# EAGLE design shield (EAGLE 7.7.0)
DRAWING_NUMBER: V001; DRAWN: Mario Blunk / Blunk electronic; PROJECT: agile HW demo; STATUS: development

## Sheet 1 of 4: connector core
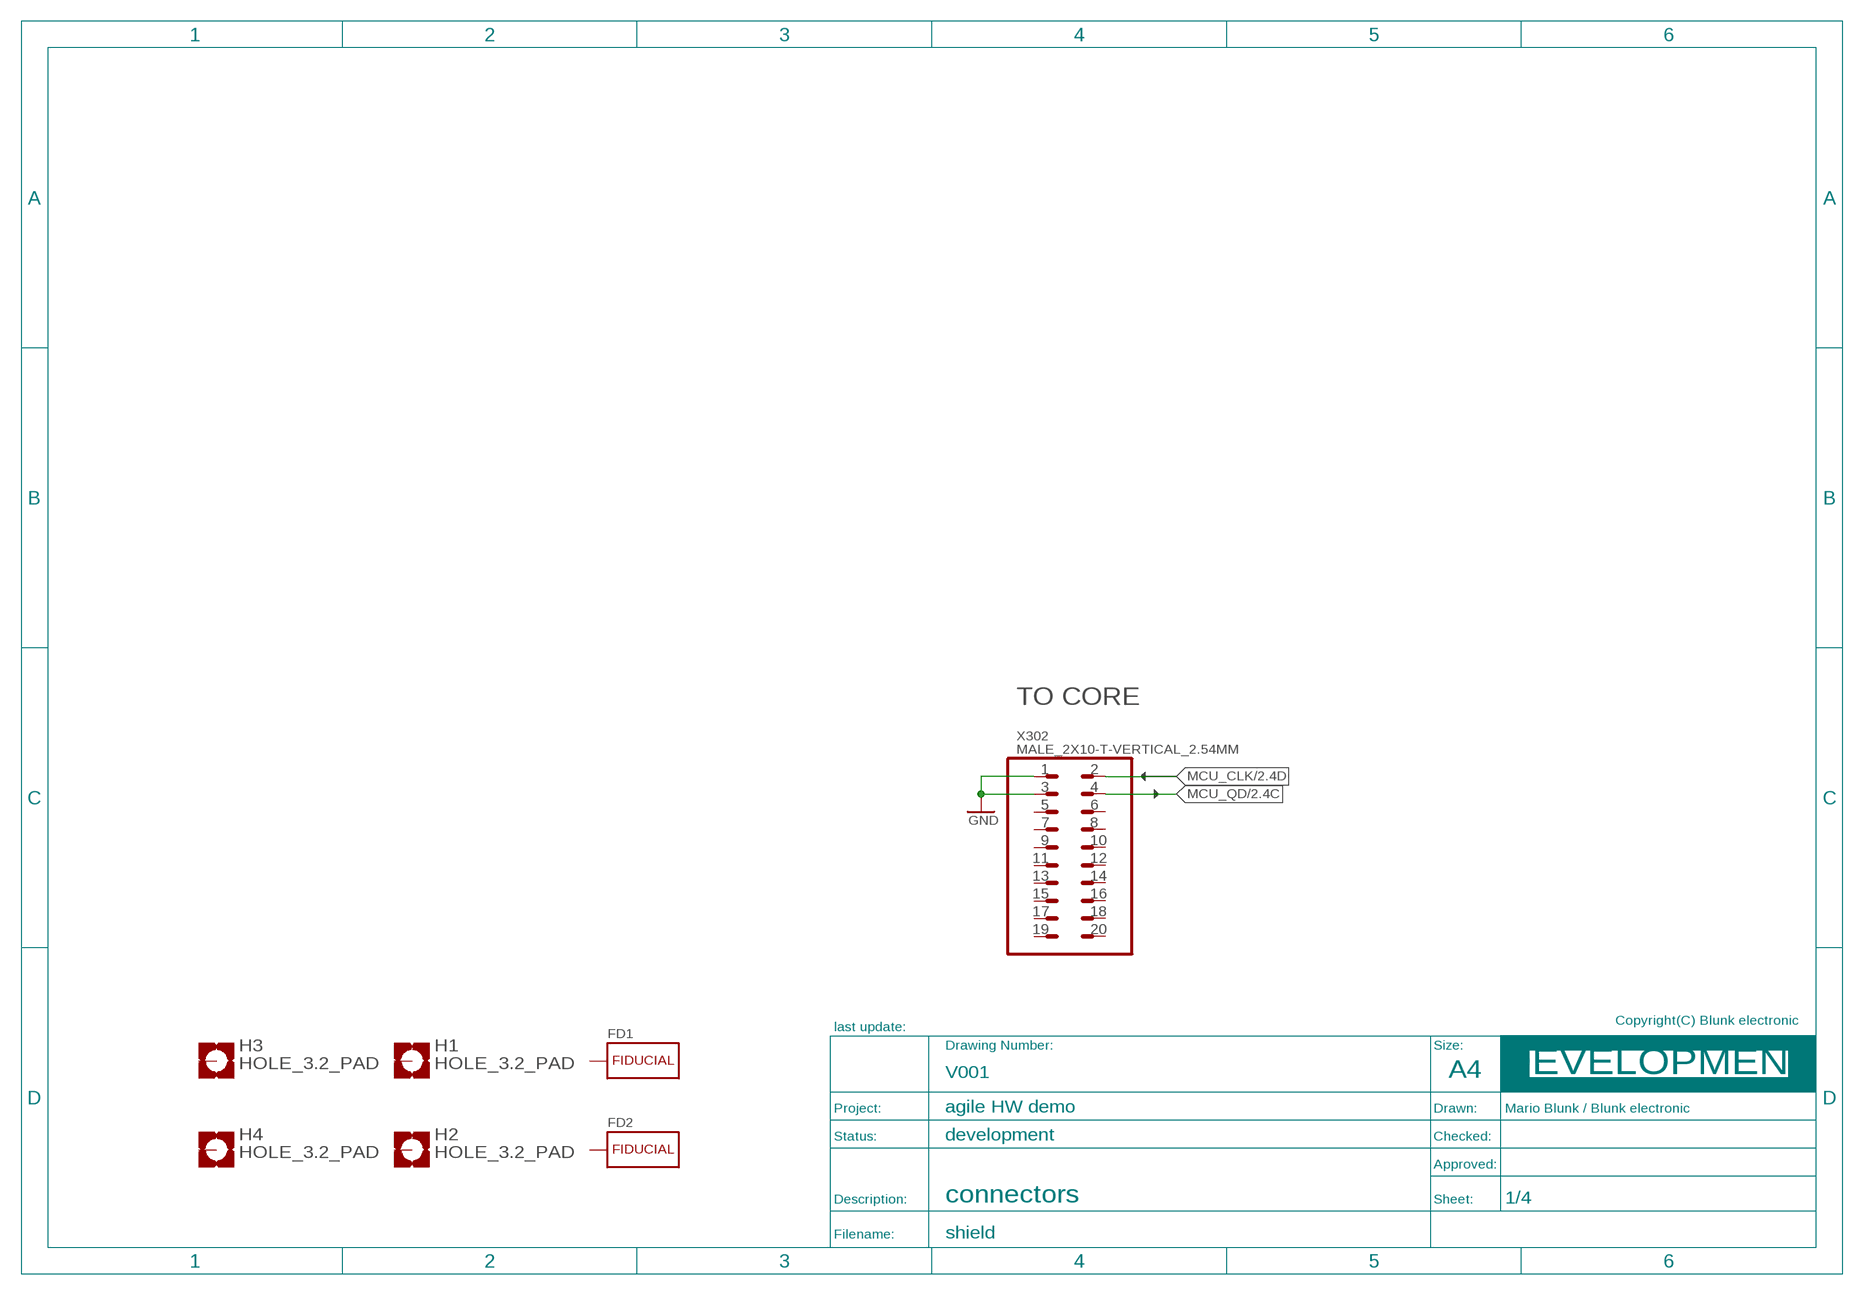
[diagram p0: schematic, sheet 1]
FRAME_DEVELOPMENT1 (A4_LANDSCAPE_DEVELOPMENT): BOM: NO; COMMISSIONED: 2013-08-30; DESCRIPTION: connectors
U$10 (ARROW_1): BOM: NO; COMMISSIONED: 2013-08-30
U$11 (ARROW_1): BOM: NO; COMMISSIONED: 2013-08-30

### Parts
FD1  FIDUCIAL_CROSSHAIR  [CROSSHAIR]
FD2  FIDUCIAL_CROSSHAIR  [CROSSHAIR]
H1  HOLE_3.2_PAD  [3.2_PAD]
H2  HOLE_3.2_PAD  [3.2_PAD]
H3  HOLE_3.2_PAD  [3.2_PAD]
H4  HOLE_3.2_PAD  [3.2_PAD]
X302  MALE_2X10-T-VERTICAL_2.54MM  [T_MALE_2X10_VERTICAL_GRID_2.54MM]

### Nets
GND: X302.1 X302.3 ; also sheet 3,4
MCU_CLK: X302.2 ; also sheet 2
MCU_QD: X302.4 ; also sheet 2
Unconnected: FD1.1(NC) FD2.1(NC) H1.H1(MOUNT) H2.H1(MOUNT) H3.H1(MOUNT) H4.H1(MOUNT) X302.5 X302.6 X302.7 X302.8 X302.9 X302.10 X302.11 X302.12 X302.13 X302.14 X302.15 X302.16 X302.17 X302.18 X302.19 X302.20

## Sheet 2 of 4: routing
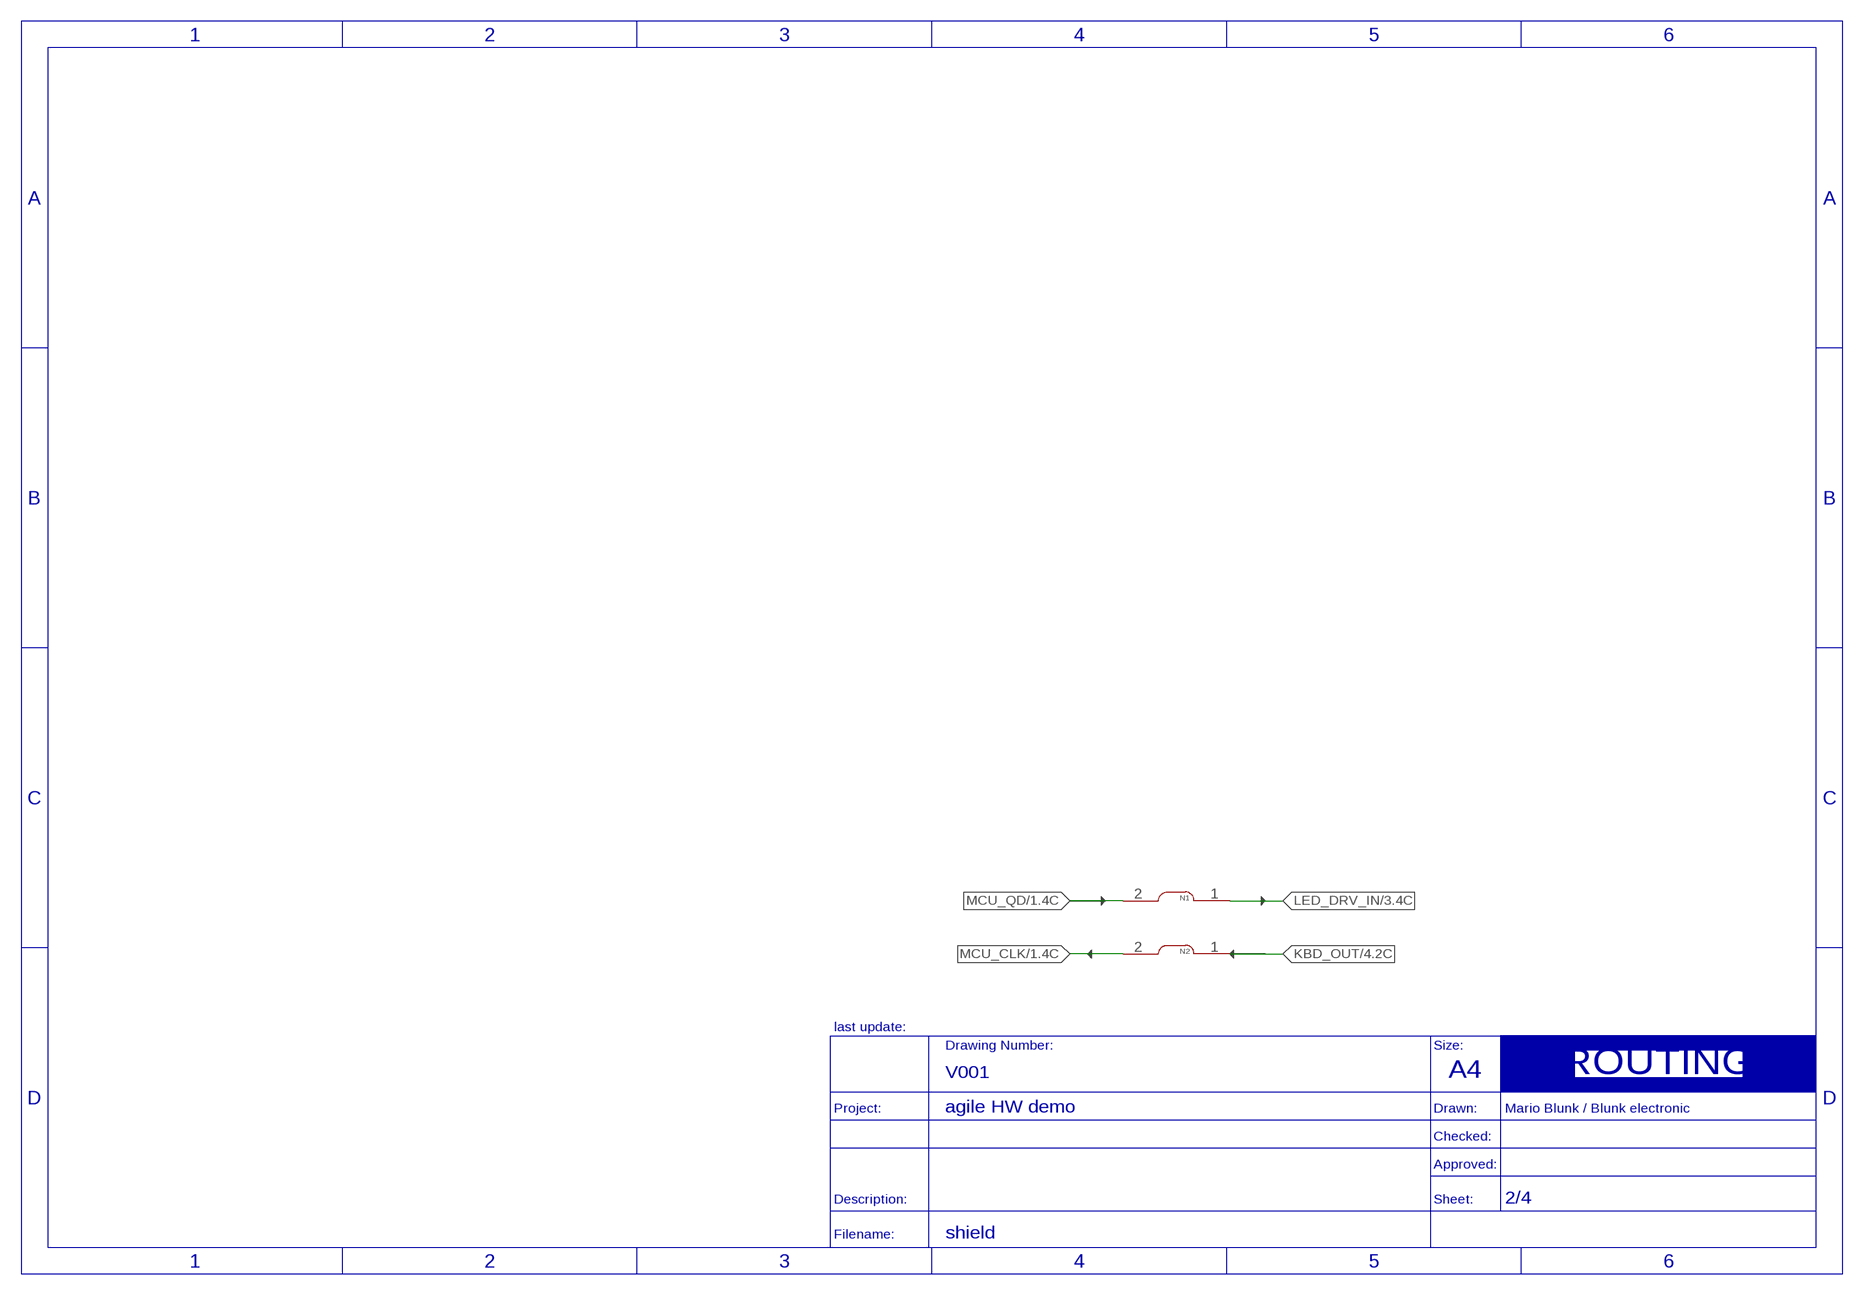
[diagram p1: schematic, sheet 2]
FRAME_NET_CHANGERS1 (A4_LANDSCAPE_NET_CHANGERS): BOM: NO; COMMISSIONED: 2013-08-30
U$2 (ARROW_1): BOM: NO; COMMISSIONED: 2013-08-30
U$3 (ARROW_1): BOM: NO; COMMISSIONED: 2013-08-30
U$4 (ARROW_1): BOM: NO; COMMISSIONED: 2013-08-30
U$5 (ARROW_1): BOM: NO; COMMISSIONED: 2013-08-30

### Parts
N1  NET_CHANGER-S-0.3MM  [S_NET_CHANGER_0.3MM]
N2  NET_CHANGER-S-0.15MM  [S_NET_CHANGER_0.15MM]

### Nets
KBD_OUT: N2.1 ; also sheet 4
LED_DRV_IN: N1.1 ; also sheet 3
MCU_CLK: N2.2 ; also sheet 1
MCU_QD: N1.2 ; also sheet 1

## Sheet 3 of 4: connector LED driver module
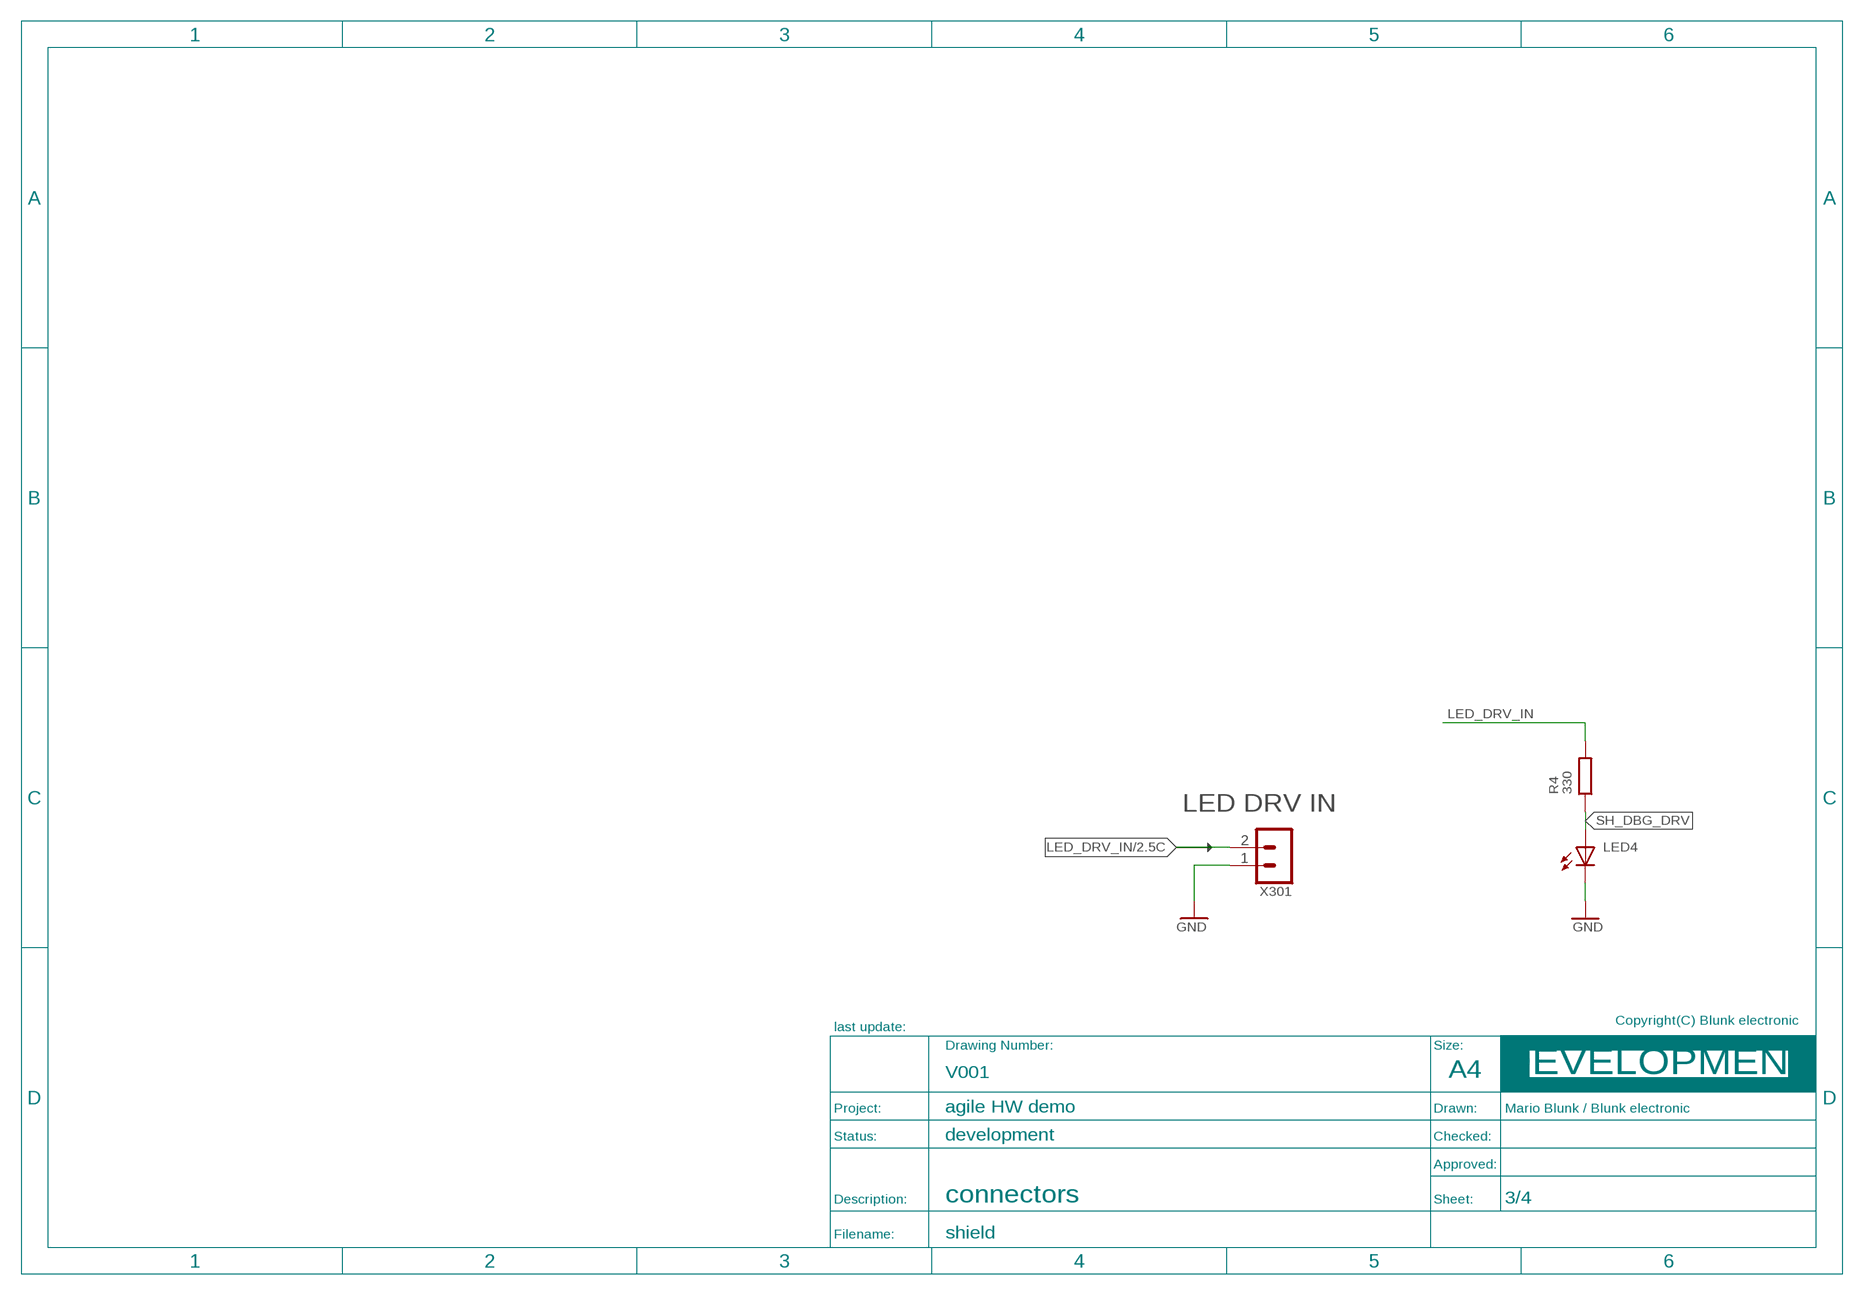
[diagram p2: schematic, sheet 3]
FRAME_DEVELOPMENT2 (A4_LANDSCAPE_DEVELOPMENT): BOM: NO; COMMISSIONED: 2013-08-30; DESCRIPTION: connectors
U$1 (ARROW_1): BOM: NO; COMMISSIONED: 2013-08-30

### Parts
LED4  LED_S_0805  [S_0805]
R4  330  R_S_0805  [S_0805]
X301  MALE_2X1-T-VERTICAL  [T_MALE_2X1_VERTICAL_PITCH_2MM54]

### Nets
GND: LED4.C X301.1 ; also sheet 1,4
LED_DRV_IN: R4.2 X301.2 ; also sheet 2
SH_DBG_DRV: LED4.A R4.1

## Sheet 4 of 4: connector keyboard module
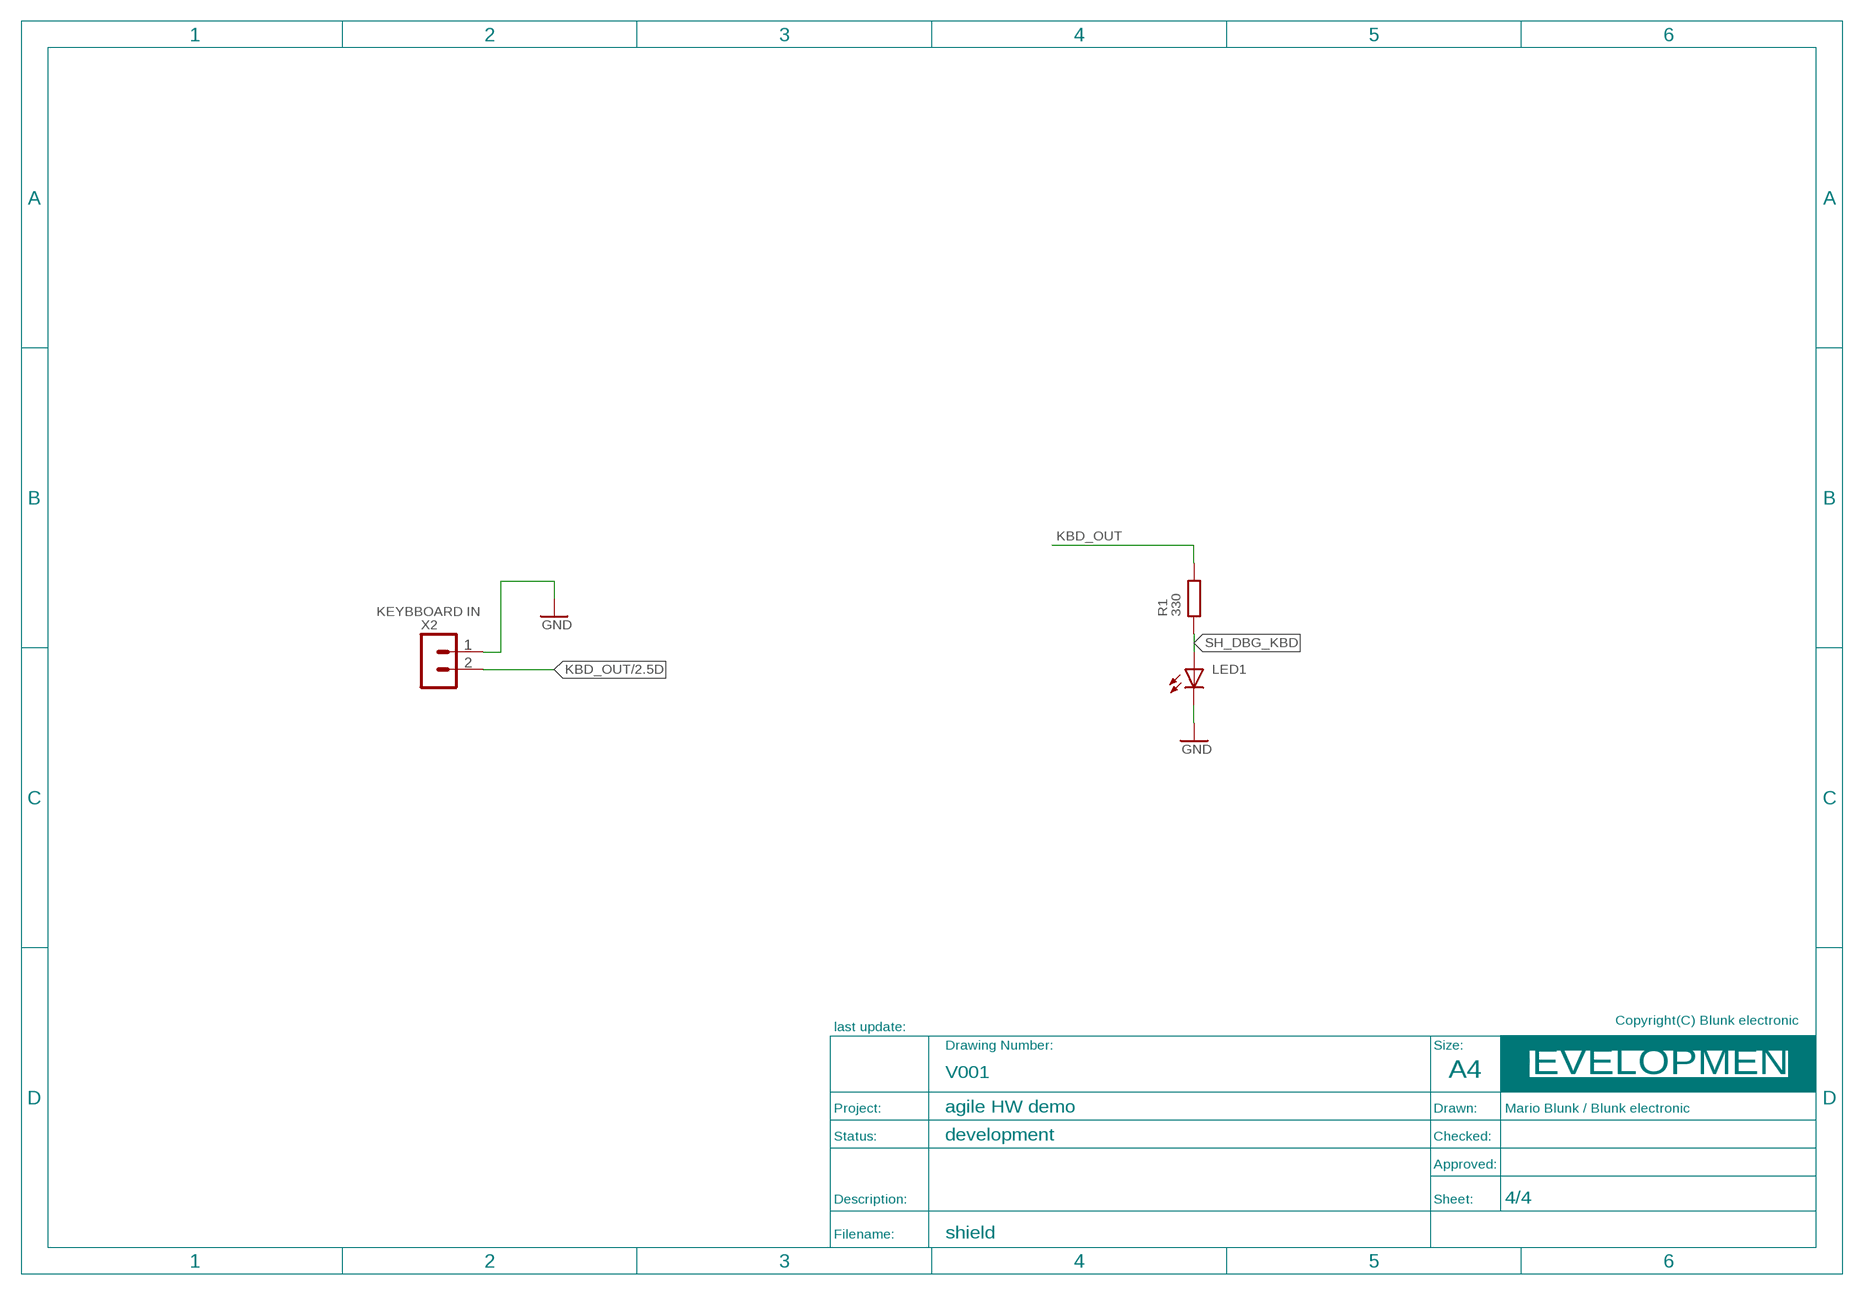
[diagram p3: schematic, sheet 4]
FRAME_DEVELOPMENT3 (A4_LANDSCAPE_DEVELOPMENT): BOM: NO; COMMISSIONED: 2013-08-30

### Parts
LED1  LED_S_0805  [S_0805]
R1  330  R_S_0805  [S_0805]
X2  MALE_2X1-T-VERTICAL  [T_MALE_2X1_VERTICAL_PITCH_2MM54]

### Nets
GND: LED1.C X2.1 ; also sheet 1,3
KBD_OUT: R1.2 X2.2 ; also sheet 2
SH_DBG_KBD: LED1.A R1.1

## Library data of the parts
FD1 FD2 = be_marks:FIDUCIAL: drawn: Mario Blunk / Blunk electronic; BOM: NO; COMMISSIONED: 2013-12-03
H1-H4 = be_holes:HOLE: edited: Mario Blunk; BOM: NO; COMMISSIONED: 2015-01-15
LED1 = be_opt:LED: single LED device drawn: Mario Blunk / Blunk electronic; BOM: YES; COMMISSIONED: 2013-08-30; FUNCTION: BOTTON PRESSED; PART_CODE_BEL: LED_PAC_S_0805_VAL_
LED4 = be_opt:LED: single LED device drawn: Mario Blunk / Blunk electronic; BOM: YES; COMMISSIONED: 2013-08-30; FUNCTION: LIGHT ACTIVE; PART_CODE_BEL: LED_PAC_S_0805_VAL_
N1 = be_con_jump:NET_CHANGER: drawn: Mario Blunk / Blunk electronic; BOM: NO; COMMISSIONED: 2014-04-09; PART_CODE_BEL: N_PAC_S_NET_CHANGER_0.3MM
N2 = be_con_jump:NET_CHANGER: drawn: Mario Blunk / Blunk electronic; BOM: NO; COMMISSIONED: 2013-08-30; PART_CODE_BEL: N_PAC_S_NET_CHANGER_0.15MM
R1 R4 = be_rcl:R: edited: Mario Blunk / Blunk electronic; BOM: YES; COMMISSIONED: 2013-08-30; PART_CODE_BEL: R_PAC_S_0805_VAL_
X2 = be_con_jump:MALE_2X1: edited: Mario Blunk / Blunk electronic; BOM: YES; COMMISSIONED: 2013-08-30; FUNCTION: KEYBBOARD IN; PART_CODE_BEL: X_PAC_T_MALE_2X1_VERTICAL_PITCH_2mm54; UPDATED: 2018-08-01
X301 = be_con_jump:MALE_2X1: edited: Mario Blunk / Blunk electronic; BOM: YES; COMMISSIONED: 2013-08-30; FUNCTION: LED DRV IN; PART_CODE_BEL: X_PAC_T_MALE_2X1_VERTICAL_PITCH_2mm54; UPDATED: 2018-08-01
X302 = be_con_jump:MALE_2X10: drawn: Mario Blunk / Blunk electronic; BOM: YES; COMMISSIONED: 2013-08-30; FUNCTION: TO CORE; PART_CODE_BEL: X_PAC_T_MALE_2X10_VERTICAL_GRID_2.54mm

## Board
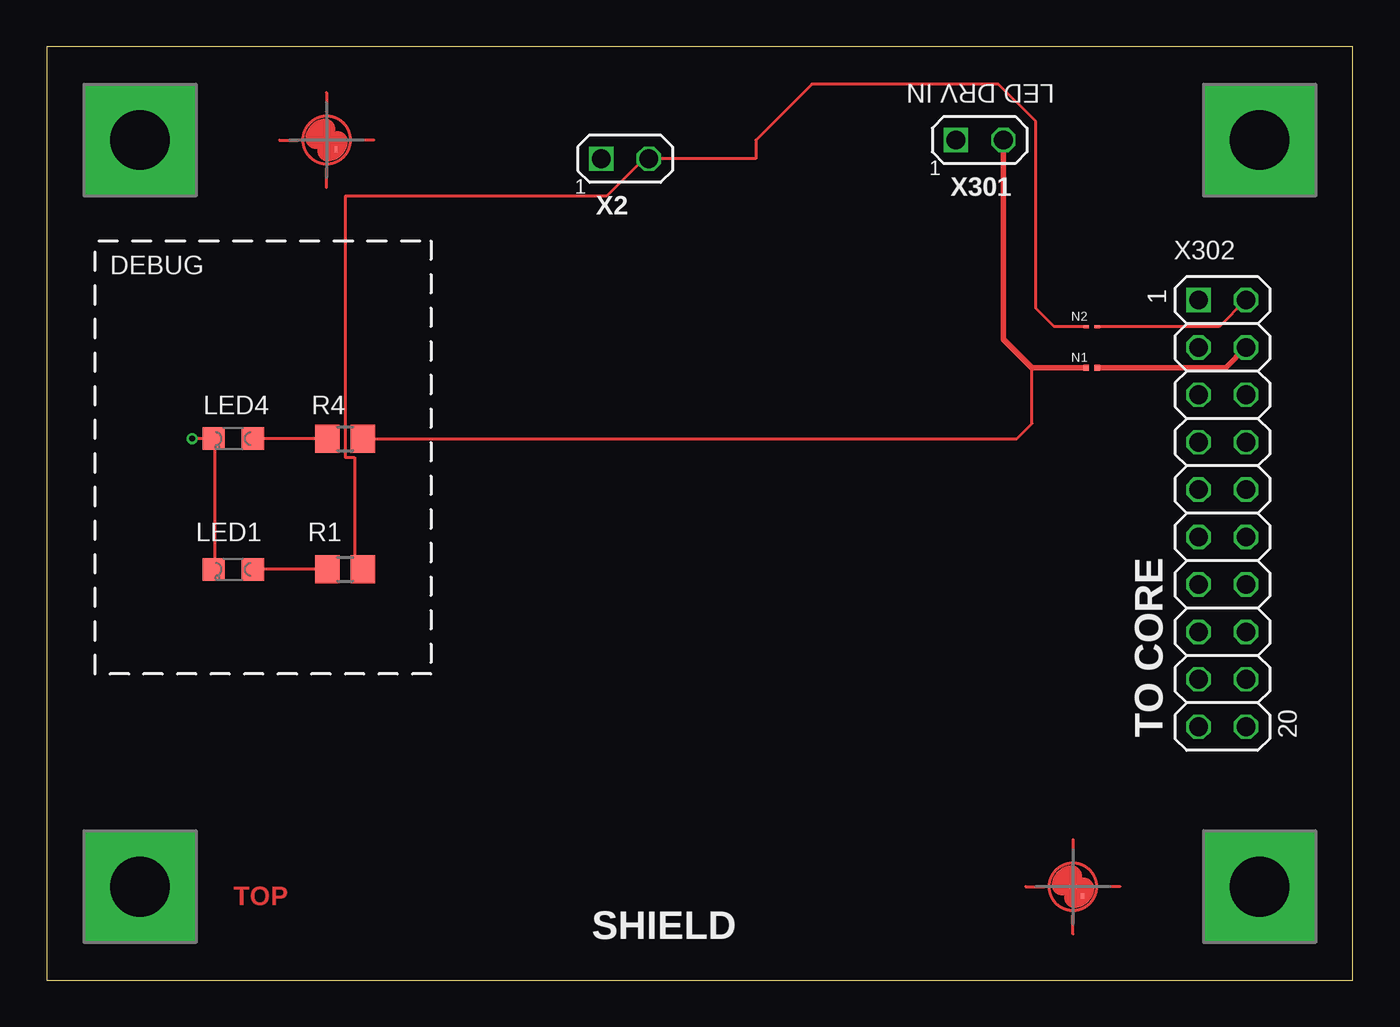
[diagram p4: board, top side]
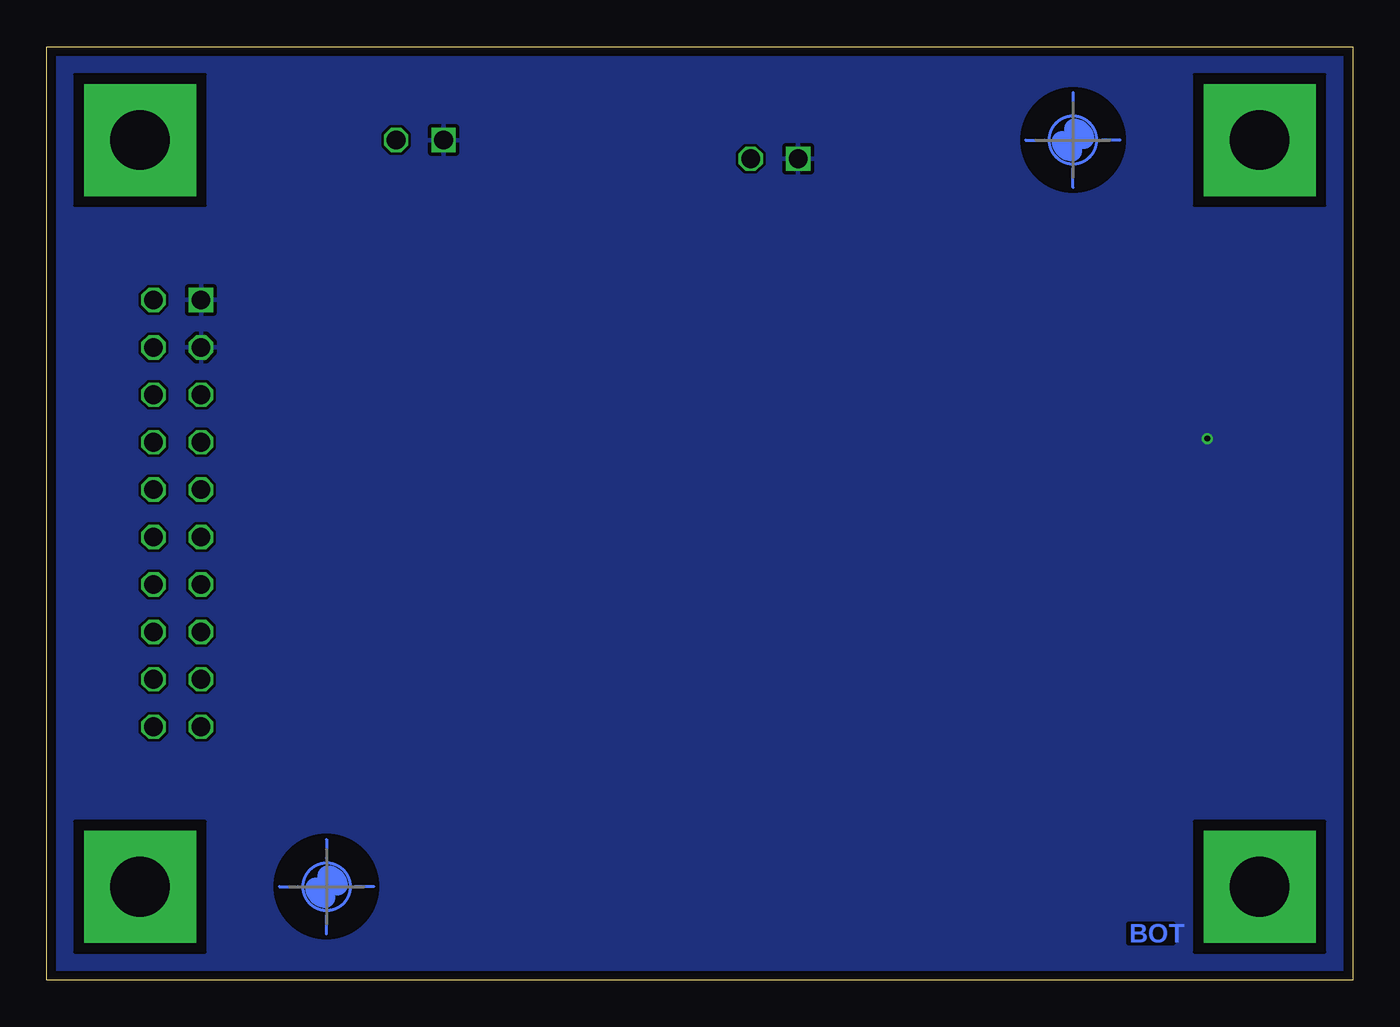
[diagram p5: board, bottom side, seen from below]

Size 70 x 50 mm. Coordinates in mm from the lower left corner, seen from the top.
Outline: 0,0 70,0 70,50 0,50 0,0
Copper layers (1+2*15+16): Top 0.018mm / dielectric 0.37mm / Route2 0.035mm / dielectric 0.65mm / Route15 0.035mm / dielectric 0.37mm / Bottom 0.018mm
Design rules "JLP_ML4_std": minimum track width 0.15mm, minimum drill 0.3mm, track to track 0.15mm, track to pad 0.15mm, pad to pad 0.15mm, via to via 0.15mm, smd to smd 0.15mm, copper to edge 0.5mm, drill to drill 0.2mm, minimum pad ring 0.15mm, minimum via ring 0.15mm, stop-mask expansion 0.075mm, vias tented up to drill 0.3mm, thermal gap 0.2mm

### Footprints (pad centres in the part's own frame; a part is rotated, then mirrored left to right if it is on the bottom)
CROSSHAIR = smd 0.305 x 0.152: 1 0.5,0.5
3.2_PAD = drill 3.2 pad 6 square: H1 0,0
S_0805 = smd 1.2 x 1.2: A 0,-1.05; C 0,1.05
S_NET_CHANGER_0.3MM = smd 0.3 x 0.3: 1 -0.3,0; 2 0.3,0
S_NET_CHANGER_0.15MM = smd 0.3 x 0.15: 1 -0.3,0; 2 0.3,0
S_0805' = smd 1.3 x 1.5: 1 -0.95,0; 2 0.95,0
T_MALE_2X1_VERTICAL_PITCH_2MM54 = drill 1 square: 1 0,-1.27 | drill 1 octagon: 2 0,1.27
T_MALE_2X10_VERTICAL_GRID_2.54MM = drill 1 square: 1 -11.43,-1.27 | drill 1 octagon: 2 -11.43,1.27; 3 -8.89,-1.27; 4 -8.89,1.27; 5 -6.35,-1.27; 6 -6.35,1.27; 7 -3.81,-1.27; 8 -3.81,1.27; 9 -1.27,-1.27; 10 -1.27,1.27; 11 1.27,-1.27; 12 1.27,1.27; 13 3.81,-1.27; 14 3.81,1.27; 15 6.35,-1.27; 16 6.35,1.27; 17 8.89,-1.27; 18 8.89,1.27; 19 11.43,-1.27; 20 11.43,1.27

### Placement (x,y rotation side)
FD1  15,45 270 top
FD2  55,5 270 top
H1  65,45 270 top
H2  5,5 270 top
H3  5,45 270 top
H4  65,5 270 top
LED1  10,22 90 top
LED4  10,29 90 top
N1  56,32.8 0 top
N2  56,35 0 top
R1  330  [S_0805']  16,22 0 top
R4  330  [S_0805']  16,29 0 top
U$9  [A4_LANDSCAPE]  -158.4,-57 0 top  (outside the outline)
X2  31,44 270 top
X301  50,45 270 top
X302  63,25 270 top

### Tracks (layer width: path | path; a pad name or v marks a point on that pad's centre or on a via)
GND  (via drill 0.3)
  Top 0.15: v7.8,29 LED4.C 9,29 9,22 LED1.C
  pour Bottom: 0,50 70,50 70,0 0,0
  pour Bottom: 0,50 70,50 70,0 0,0
KBD_OUT
  Top 0.15: R1.2 16.5,22 16.5,28 16,28 16,42 30,42 32,44 X2.2 38,44 38,45 41,48 51,48 53,46 53,36 54,35 N2.1
LED_DRV_IN
  Top 0.15: R4.2 52,29 52.8,29.8 52.8,32.8
  Top 0.3: N1.1 52.8,32.8 51.27,34.33 X301.2
MCU_CLK
  Top 0.15: X302.2 62.84,35 N2.2
MCU_QD
  Top 0.3: X302.4 63.18,32.8 N1.2
SH_DBG_DRV
  Top 0.15: R4.1 LED4.A
SH_DBG_KBD
  Top 0.15: R1.1 LED1.A

### Text on the board
Top: TOP
Bottom: BOT
tPlace: DEBUG | SHIELD